# Altium schematic sheet Power.SchDoc
size A
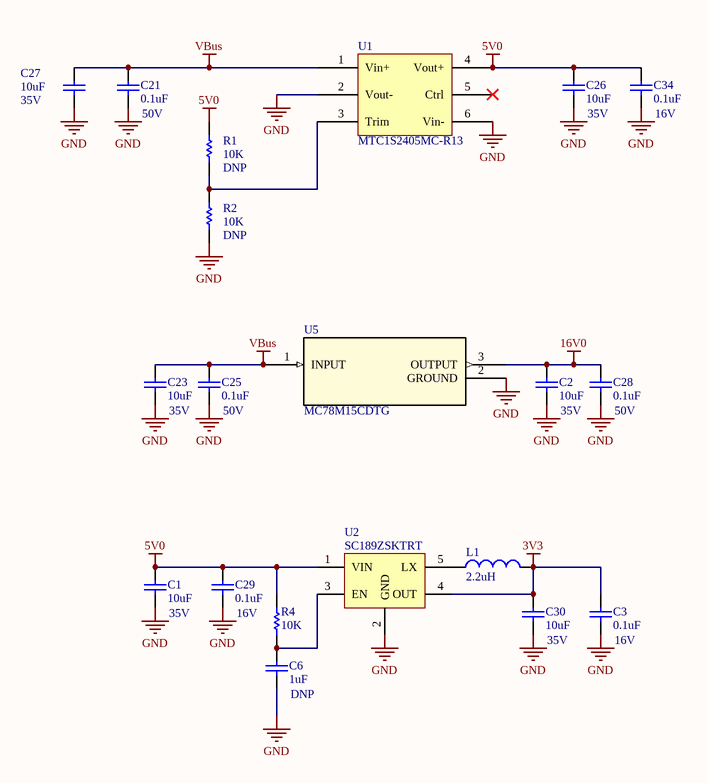
[diagram p0: Power.SchDoc]

## Parts
C1  10uF  Voltage - Rated: 35V  [CAPC2012X145N]
C2  10uF  Voltage - Rated: 35V  [CAPC2012X145N]
C3  0.1uF  Voltage - Rated: 16V  [CAPC1005(0402)N]
C6  1uF  [CAPC1005(0402)N]
C21  0.1uF  Voltage - Rated: 50V  [CAPC1005(0402)N]
C23  10uF  Voltage - Rated: 35V  [CAPC2012X145N]
C25  0.1uF  Voltage - Rated: 50V  [CAPC1005(0402)N]
C26  10uF  Voltage - Rated: 35V  [CAPC2012X145N]
C27  10uF  Voltage - Rated: 35V  [CAPC2012X145N]
C28  0.1uF  Voltage - Rated: 50V  [CAPC1005(0402)N]
C29  0.1uF  Voltage - Rated: 16V  [CAPC1005(0402)N]
C30  10uF  Voltage - Rated: 35V  [CAPC2012X145N]
C34  0.1uF  Voltage - Rated: 16V  [CAPC1005(0402)N]
L1  2.2uH  [IND_TAIYO_NRS401]
R1  value 10K  [0402]  (hidden comment: Res1)
R2  value 10K  [0402]  (hidden comment: Res1)
R4  10K  [RESC1005(0402)N]
U1  MTC1S2405MC-R13  [MTC1S2405MC-R13]
U2  SC189ZSKTRT  [SOT23-5]
U5  MC78M15CDTG  [DPAK-3]

## Nets
3V3: C3.2 C30.1 L1.2 U2.4(OUT)
5V0: C1.1 C26.1 C29.2 C34.2 R1.2 R4.2 U1.4(Vout+) U2.1(VIN)
16V0: C2.1 C28.2 U5.3(OUTPUT)
GND: C1.2 C2.2 C3.1 C6.2 C21.1 C23.2 C25.1 C26.2 C27.2 C28.1 C29.1 C30.2 C34.1 R2.1 U1.2(Vout-) U1.6(Vin-) U2.2(GND) U5.2(GROUND)
VBus: C21.2 C23.1 C25.2 C27.1 U1.1(Vin+) U5.1(INPUT)
NetC6_1: C6.1 R4.1 U2.3(EN)
NetL1_1: L1.1 U2.5(LX)
NetR1_1: R1.1 R2.2 U1.3(Trim)

Not connected (* = marked no-connect by the designer): U1 5(Ctrl)*

## Library data of the parts
C1 C2 C23 C26 C27 C30 = CAP: Manufacturer 1: Samsung; Manufacturer Part Number 1: GRM21BC8YA106ME11L; Tolerance: ±10%; Level: 1; Vendor PN: 490-10505-1-ND; RoHS: RoHS Compliant; Category: Capacitors; Capacitance: 10uF; Mounting Type: Surface Mount, MLCC; Operating Temperature: -55°C ~ 85°C; Package / Case: 0805 (2012 Metric); Size / Dimension: 0.039" L x 0.020" W (1.00mm x 0.50mm); Thickness (Max): 0.022" (0.55mm)
C3 C29 C34 = CAP: CAP CER 0.1UF 16V X5R 0402; Manufacturer 1: Murata; Manufacturer Part Number 1: GRM155R61C104KA88D; Tolerance: ±10%; Level: 1; Vendor PN: 490-5415-1-ND; Temperature Coefficient: X5R; RoHS: RoHS Compliant; Category: Capacitors; Capacitance: 0.1uF; Mounting Type: Surface Mount, MLCC; Operating Temperature: -55°C ~ 85°C; Package / Case: 0402 (1005 Metric); Size / Dimension: 0.039" L x 0.020" W (1.00mm x 0.50mm); Thickness (Max): 0.022" (0.55mm)
C6 = CAP: Manufacturer 1: Samsung; Manufacturer Part Number 1: CL05A105KO5NNNC; Temperature Coefficient: X5R; Tolerance: ±10%; Voltage - Rated: 16V; Level: 1; RoHS: RoHS Compliant; Category: Capacitors; Capacitance: 1uF; Mounting Type: Surface Mount, MLCC; Operating Temperature: -55°C ~ 85°C; Package / Case: 0402 (1005 Metric); Size / Dimension: 0.039" L x 0.020" W (1.00mm x 0.50mm); Thickness (Max): 0.022" (0.55mm); DNP: DNP
C21 C25 C28 = CAP: CAP CER 0.1UF 16V X5R 0402; Manufacturer 1: Murata; Manufacturer Part Number 1: GRM155R71H104KE14J; Tolerance: ±10%; Level: 1; Vendor PN: 490-13342-1-ND; Temperature Coefficient: X5R; RoHS: RoHS Compliant; Category: Capacitors; Capacitance: 0.1uF; Mounting Type: Surface Mount, MLCC; Operating Temperature: -55°C ~ 85°C; Package / Case: 0402 (1005 Metric); Size / Dimension: 0.039" L x 0.020" W (1.00mm x 0.50mm); Thickness (Max): 0.022" (0.55mm)
L1 = IND: Inductor, fixed, 2.2UH 1.5A 98 MOHM SMD; Manufacturer 1: Taiyo Yuden; Manufacturer Part Number 1: NRS4012T2R2MDGJ; Tolerance: 20%; DC Resistance (DCR): 60mR; Shielding: Shielded; Saturation Current: 1.65A; Max DC Current: 1.9A; Test Frequency: 1MHz; Vendor PN: 587-2882-1-ND; Case Code (Metric): 4012; Min Operating Temperature: -40°C; Max Operating Temperature: 105°C; Inductance: 2.2uH; Package Quantity: 2000; Termination: SMD/SMT; Composition: Wirewound; Length: 4mm; Height: 1.2mm; Width: 4mm; Depth: 4mm; Radiation Hardening: No; Lead Free: Lead Free; Category: inductors
R1 R2 = Res1: Resistor; Vendor PN: 311-10.0KLRCT-ND; Published: 8-Jun-2000; LatestRevisionDate: 17-Jul-2002; LatestRevisionNote: Re-released for DXP Platform.; PackageReference: AXIAL-0.3; Publisher: Altium Limited; PackageDescription: Axial Device, Thru-Hole; 2 Leads; 0.3 in Pin Spacing; DNP: DNP
R4 = RES: Resistor, Chip; Manufacturer 1: Stackpole; Manufacturer Part Number 1: RMCF0402FT10K0; Level: 1; Vendor PN: RMCF0402FT10K0CT-ND; Category: Resistors; Number of Terminations: 2; Composition: -; Power (Watts): -; Resistance: 10K; Temperature Coefficient: -; Tolerance: -; Package / Case: 0402 (1005 Metric)
U1 = MTC1S2405MC-R13: Vendor PN: 811-3081-1-ND
U2 = VREG-DCDC-SC189: IC, Buck Converter, SC189ZSKTRT; Manufacturer 1: Semtech; Vendor PN: SC189ZSKCT-ND; Manufacturer Part Number 1: SC189ZSKTRT; Category: ICs
U5 = MC78M15CDTG: No Description Available; Vendor: ON Semiconductor; Vendor PN: MC78M15CDTGOS-ND; Manufacturer_Part_Number: MC78M15CDTG; Copyright: Copyright (C) 2016 Accelerated Designs. All rights reserved; RefDes: RefDes; Type: DEV; Value: Value